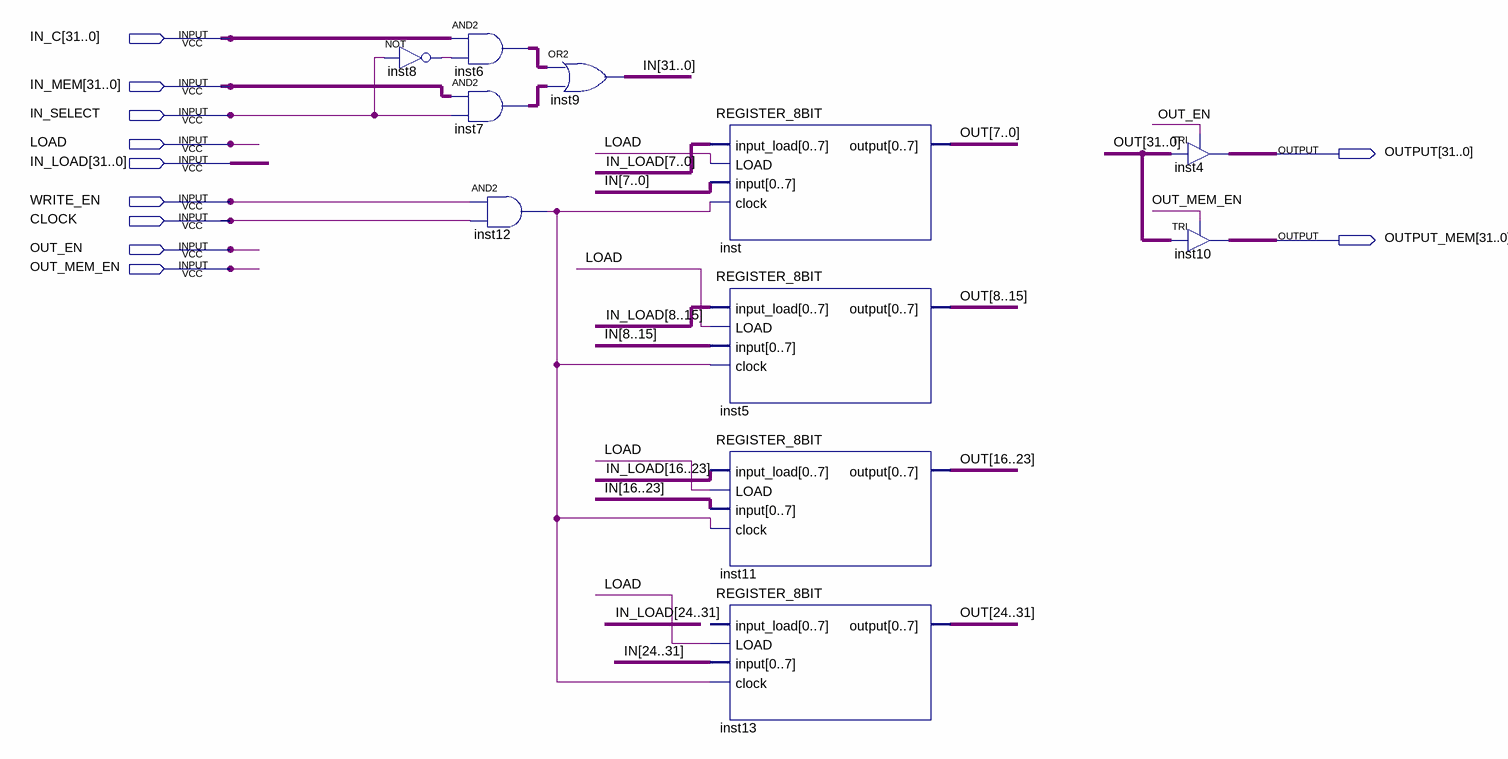
[diagram p0: schematic sheet]
// Quartus schematic REGISTER_32BIT.bdf as structural Verilog: 11 symbols, 11 pins
module REGISTER_32BIT (
  input  [31:0] IN_C,
  input  [31:0] IN_MEM,
  input  IN_SELECT,
  input  LOAD,
  input  [31:0] IN_LOAD,
  input  WRITE_EN,
  input  CLOCK,
  input  OUT_EN,
  input  OUT_MEM_EN,
  output [31:0] OUTPUT,
  output [31:0] OUTPUT_MEM
);

  wire inst8_out, inst12_out;
  wire [31:0] IN, inst6_out, inst7_out, OUT;

  assign inst6_out = IN_C & {32{inst8_out}};  // AND2 inst6, 32 bits wide
  not inst8 (inst8_out, IN_SELECT);
  assign inst7_out = IN_MEM & {32{IN_SELECT}};  // AND2 inst7, 32 bits wide
  and inst12 (inst12_out, WRITE_EN, CLOCK);
  assign IN = inst6_out | inst7_out;  // OR2 inst9, 32 bits wide
  REGISTER_8BIT inst (
    .input_load(IN_LOAD[7:0]), .LOAD(LOAD), .\input (IN[7:0]), .clock(inst12_out), .\output (OUT[7:0]));
  REGISTER_8BIT inst5 (
    .input_load({IN_LOAD[8], IN_LOAD[9], IN_LOAD[10], IN_LOAD[11], IN_LOAD[12], IN_LOAD[13], IN_LOAD[14], IN_LOAD[15]}),
    .LOAD(LOAD), .\input ({IN[8], IN[9], IN[10], IN[11], IN[12], IN[13], IN[14], IN[15]}),
    .clock(inst12_out), .\output ({OUT[8], OUT[9], OUT[10], OUT[11], OUT[12], OUT[13], OUT[14], OUT[15]}));
  REGISTER_8BIT inst11 (
    .input_load({IN_LOAD[16], IN_LOAD[17], IN_LOAD[18], IN_LOAD[19], IN_LOAD[20], IN_LOAD[21], IN_LOAD[22], IN_LOAD[23]}),
    .LOAD(LOAD), .\input ({IN[16], IN[17], IN[18], IN[19], IN[20], IN[21], IN[22], IN[23]}),
    .clock(inst12_out), .\output ({OUT[16], OUT[17], OUT[18], OUT[19], OUT[20], OUT[21], OUT[22], OUT[23]}));
  REGISTER_8BIT inst13 (
    .LOAD(LOAD), .\input ({IN[24], IN[25], IN[26], IN[27], IN[28], IN[29], IN[30], IN[31]}),
    .clock(inst12_out), .\output ({OUT[24], OUT[25], OUT[26], OUT[27], OUT[28], OUT[29], OUT[30], OUT[31]}));  // open: input_load
  TRI inst4[31:0] (.IN(OUT), .OE(OUT_EN), .OUT(OUTPUT));
  TRI inst10[31:0] (.IN(OUT), .OE(OUT_MEM_EN), .OUT(OUTPUT_MEM));
endmodule
